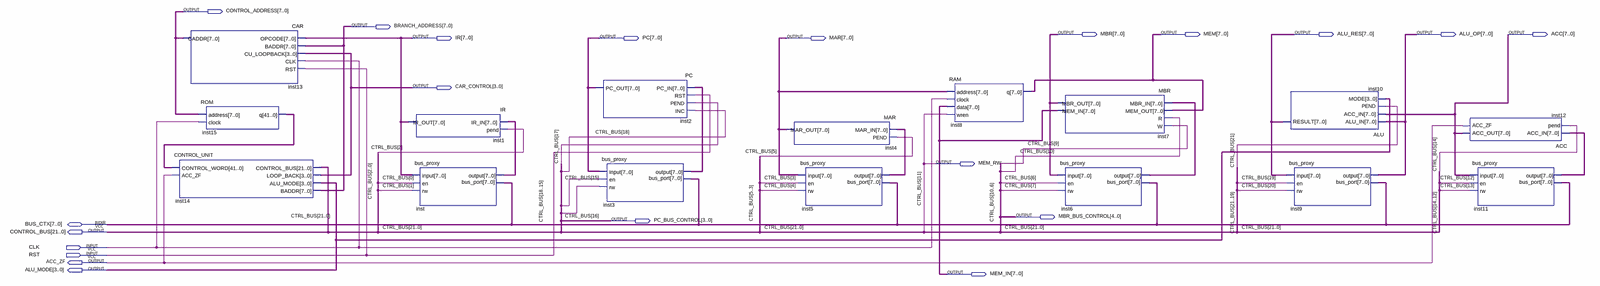
[diagram p0: schematic sheet, whole]
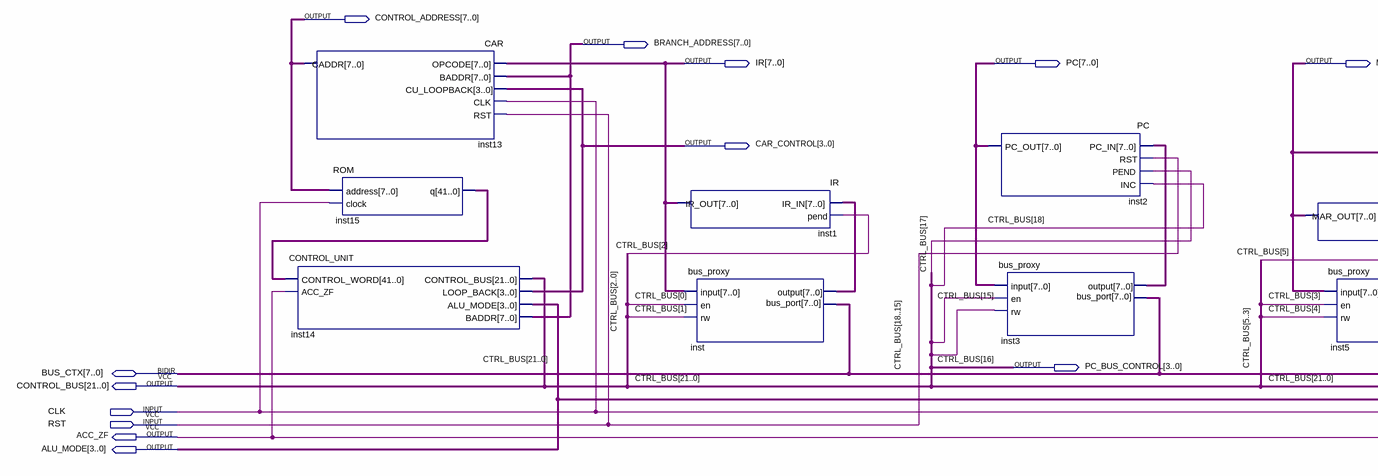
[diagram p1: schematic sheet, left part]
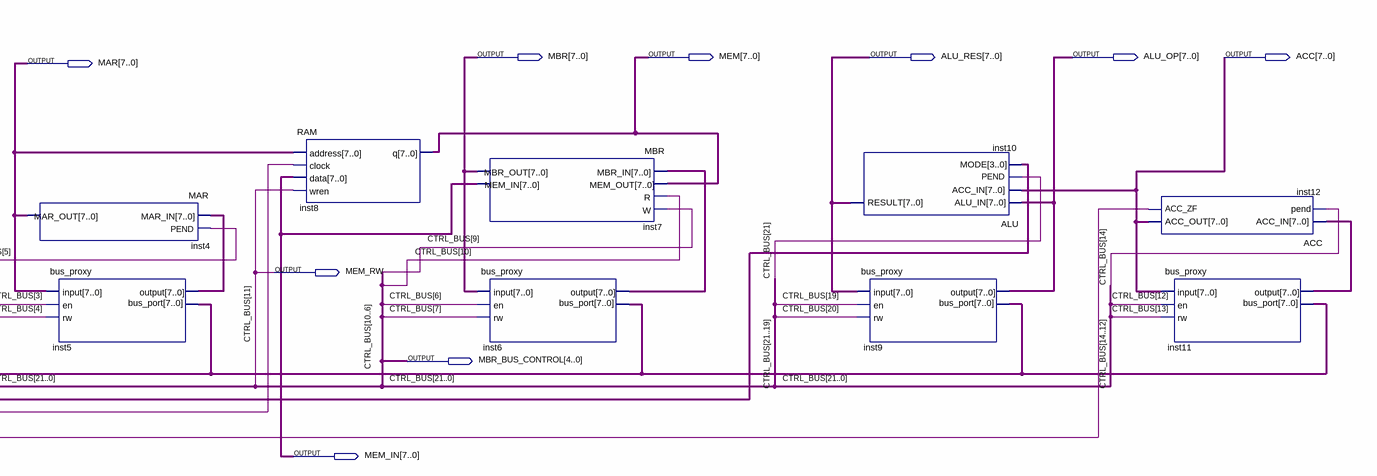
[diagram p2: schematic sheet, right part]
// Quartus schematic CPU.bdf as structural Verilog: 16 symbols, 21 pins
module CPU (
  input  CLK,
  input  RST,
  inout  [7:0] BUS_CTX,
  output [7:0] CONTROL_ADDRESS,
  output [7:0] BRANCH_ADDRESS,
  output [7:0] MBR,
  output [7:0] MEM,
  output [7:0] ALU_RES,
  output [7:0] ALU_OP,
  output [7:0] ACC,
  output [7:0] IR,
  output [7:0] PC,
  output [7:0] MAR,
  output [3:0] CAR_CONTROL,
  output MEM_RW,
  output [4:0] MBR_BUS_CONTROL,
  output [3:0] PC_BUS_CONTROL,
  output [21:0] CONTROL_BUS,
  output ACC_ZF,
  output [3:0] ALU_MODE,
  output [7:0] MEM_IN
);

  wire [7:0] inst3_output, inst5_output, inst6_output, inst11_output, inst_output;
  wire [41:0] inst15_q;

  CAR inst13 (
    .OPCODE(IR), .BADDR(BRANCH_ADDRESS), .CU_LOOPBACK(CAR_CONTROL), .CLK(CLK), .RST(RST),
    .CADDR(CONTROL_ADDRESS));
  CONTROL_UNIT inst14 (
    .CONTROL_WORD(inst15_q), .ACC_ZF(ACC_ZF), .CONTROL_BUS(CONTROL_BUS), .LOOP_BACK(CAR_CONTROL),
    .ALU_MODE(ALU_MODE), .BADDR(BRANCH_ADDRESS));
  ROM inst15 (.address(CONTROL_ADDRESS), .clock(CLK), .q(inst15_q));
  IR inst1 (.IR_IN(inst_output), .pend(CONTROL_BUS[2]), .IR_OUT(IR));
  bus_proxy inst (.en(CONTROL_BUS[0]), .rw(CONTROL_BUS[1]), .\input (IR), .\output (inst_output), .bus_port(BUS_CTX));
  PC inst2 (.PC_IN(inst3_output), .RST(RST), .PEND(CONTROL_BUS[17]), .INC(CONTROL_BUS[18]), .PC_OUT(PC));
  bus_proxy inst3 (
    .en(CONTROL_BUS[15]), .rw(CONTROL_BUS[16]), .\input (PC), .\output (inst3_output), .bus_port(BUS_CTX));
  MAR inst4 (.MAR_IN(inst5_output), .PEND(CONTROL_BUS[5]), .MAR_OUT(MAR));
  bus_proxy inst5 (
    .en(CONTROL_BUS[3]), .rw(CONTROL_BUS[4]), .\input (MAR), .\output (inst5_output), .bus_port(BUS_CTX));
  RAM inst8 (.address(MAR), .clock(CLK), .data(MEM_IN), .wren(CONTROL_BUS[11]), .q(MEM));
  MBR inst7 (
    .MBR_IN(inst6_output), .MEM_OUT(MEM), .R(CONTROL_BUS[10]), .W(CONTROL_BUS[9]), .MBR_OUT(MBR),
    .MEM_IN(MEM_IN));
  bus_proxy inst6 (
    .en(CONTROL_BUS[6]), .rw(CONTROL_BUS[7]), .\input (MBR), .\output (inst6_output), .bus_port(BUS_CTX));
  ALU inst10 (.ALU_IN(ALU_OP), .ACC_IN(ACC), .PEND(CONTROL_BUS[21]), .MODE(ALU_MODE), .RESULT(ALU_RES));
  bus_proxy inst9 (
    .en(CONTROL_BUS[19]), .rw(CONTROL_BUS[20]), .\input (ALU_RES), .\output (ALU_OP), .bus_port(BUS_CTX));
  ACC inst12 (.ACC_IN(inst11_output), .pend(CONTROL_BUS[14]), .ACC_OUT(ACC), .ACC_ZF(ACC_ZF));
  bus_proxy inst11 (
    .en(CONTROL_BUS[12]), .rw(CONTROL_BUS[13]), .\input (ACC), .\output (inst11_output), .bus_port(BUS_CTX));

  assign MBR_BUS_CONTROL = CONTROL_BUS[10:6];
  assign MEM_RW = CONTROL_BUS[11];
  assign PC_BUS_CONTROL = CONTROL_BUS[18:15];

  // Other names for the same wires on the sheet: CTRL_BUS[21:0] = CONTROL_BUS
endmodule
